# EAGLE design 16SegBoard_AutoRoute (EAGLE 9.1.0)
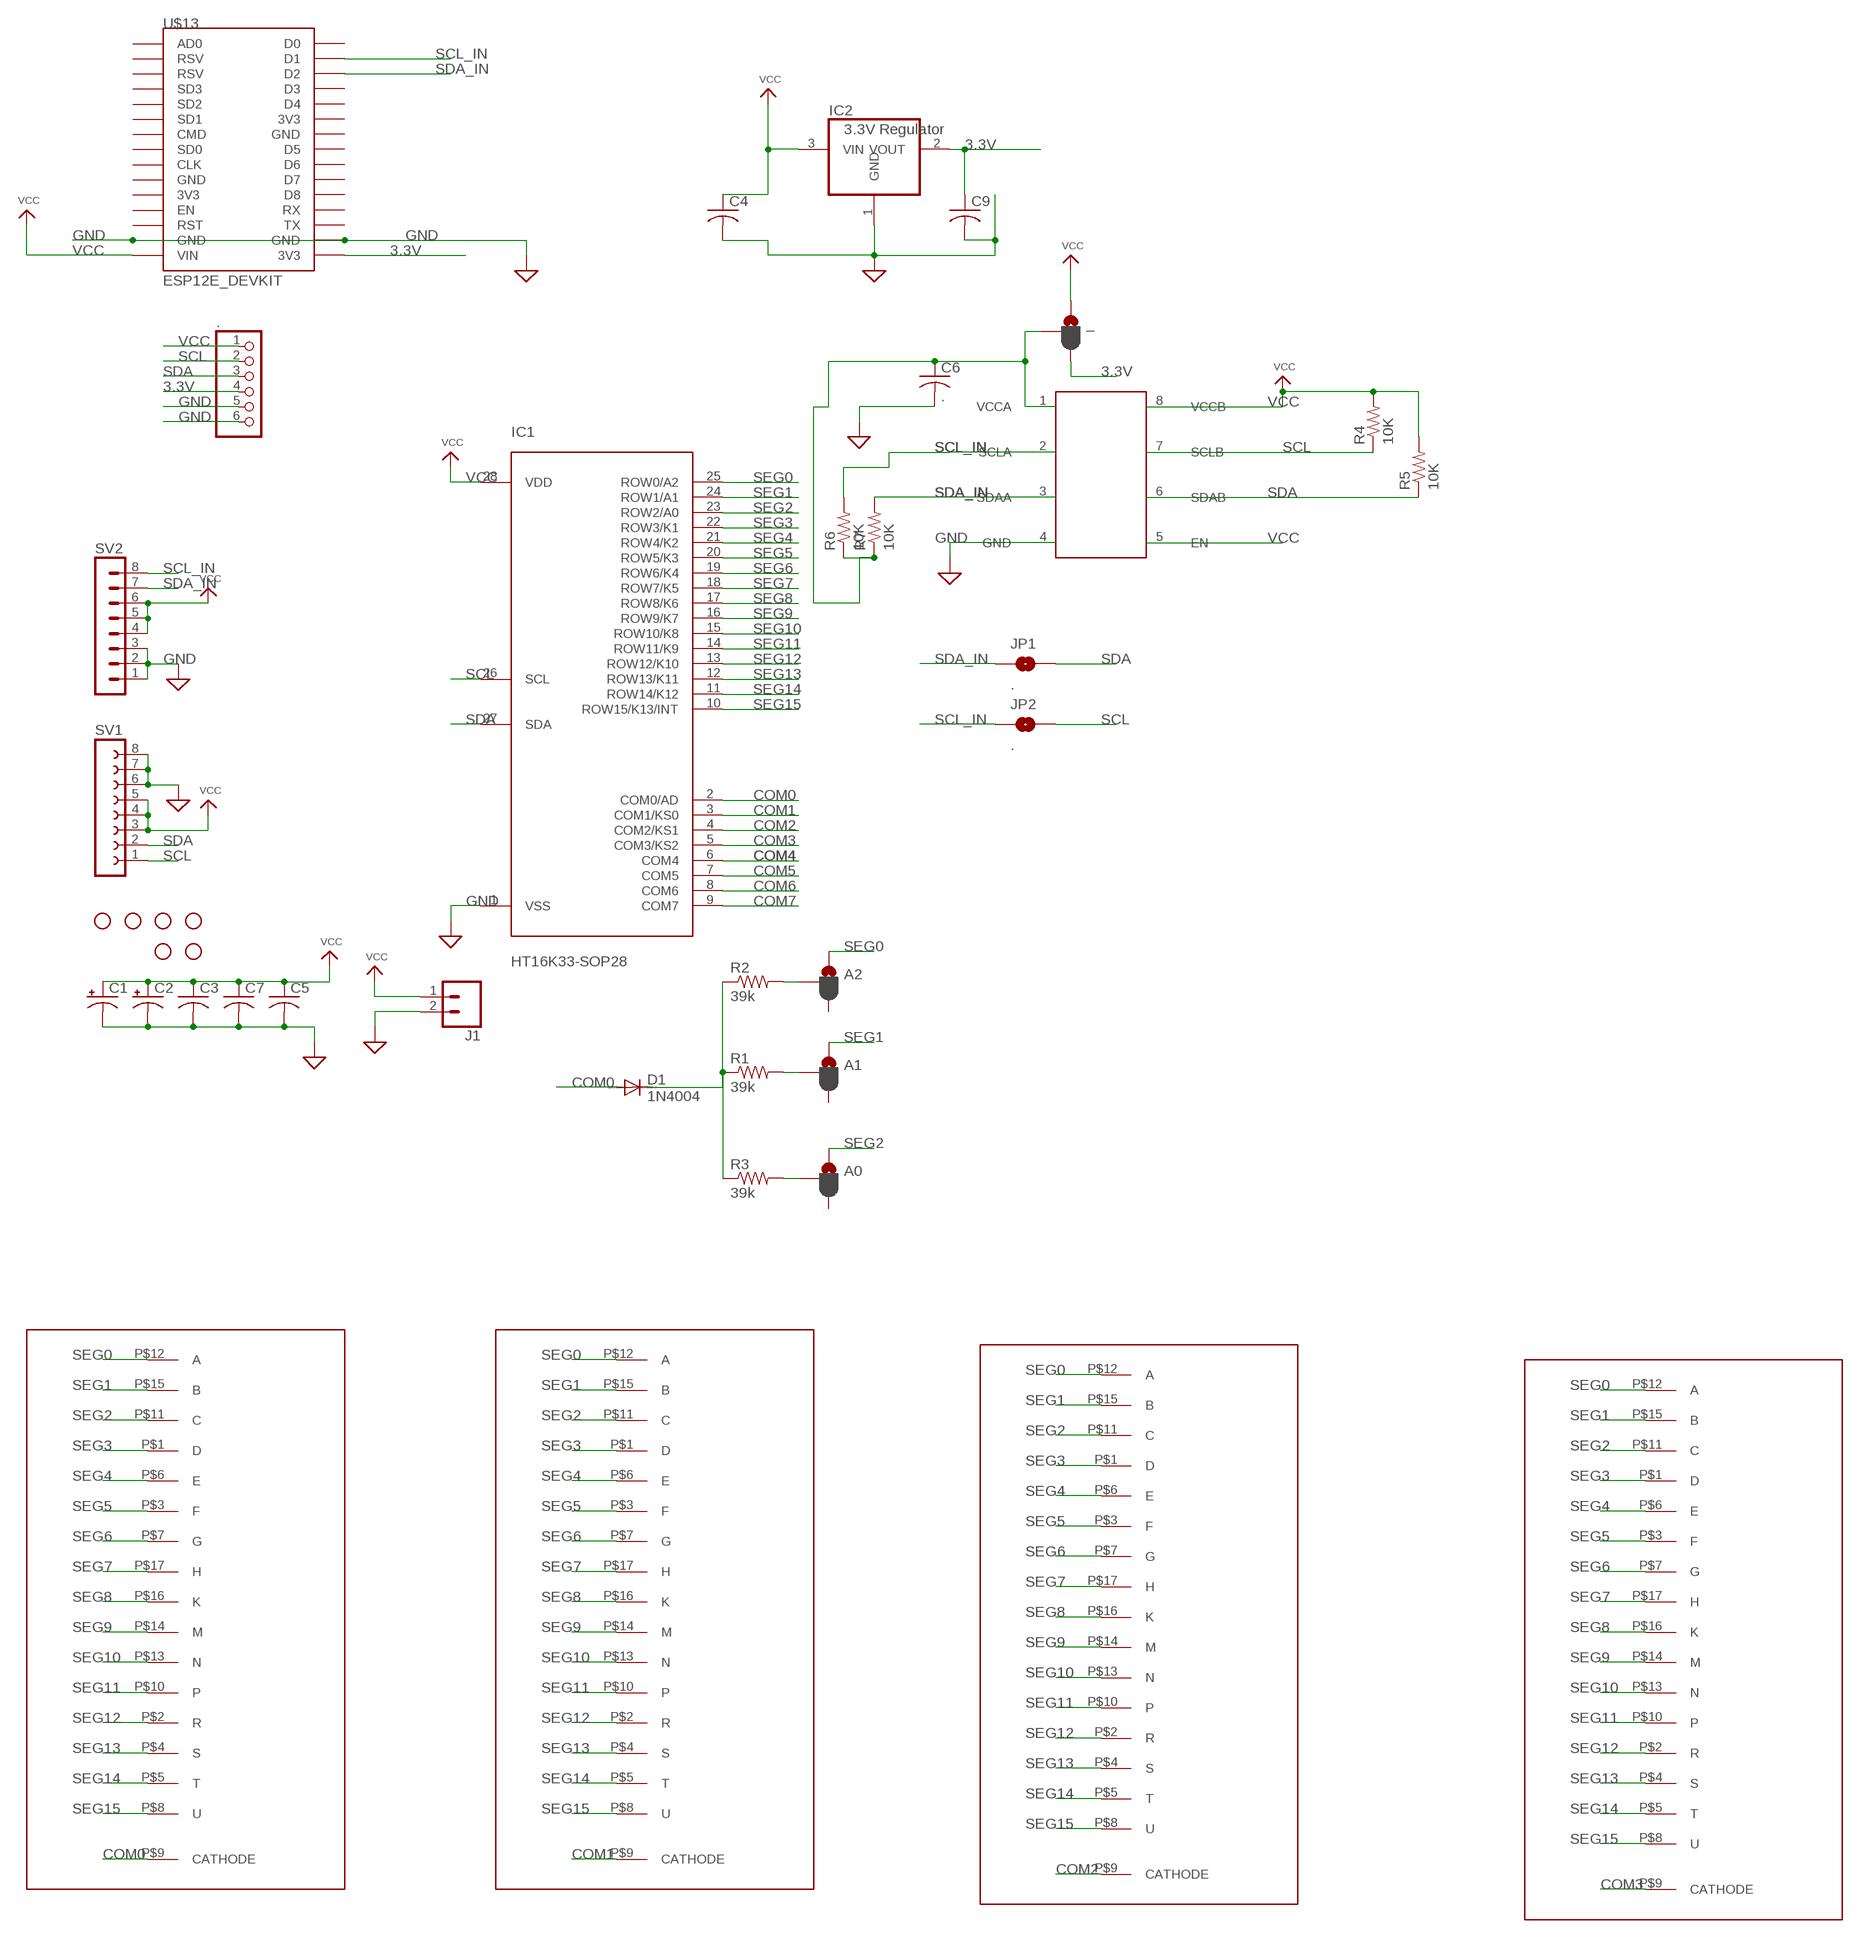
[diagram p0: schematic, sheet 1, part 1 of 2]
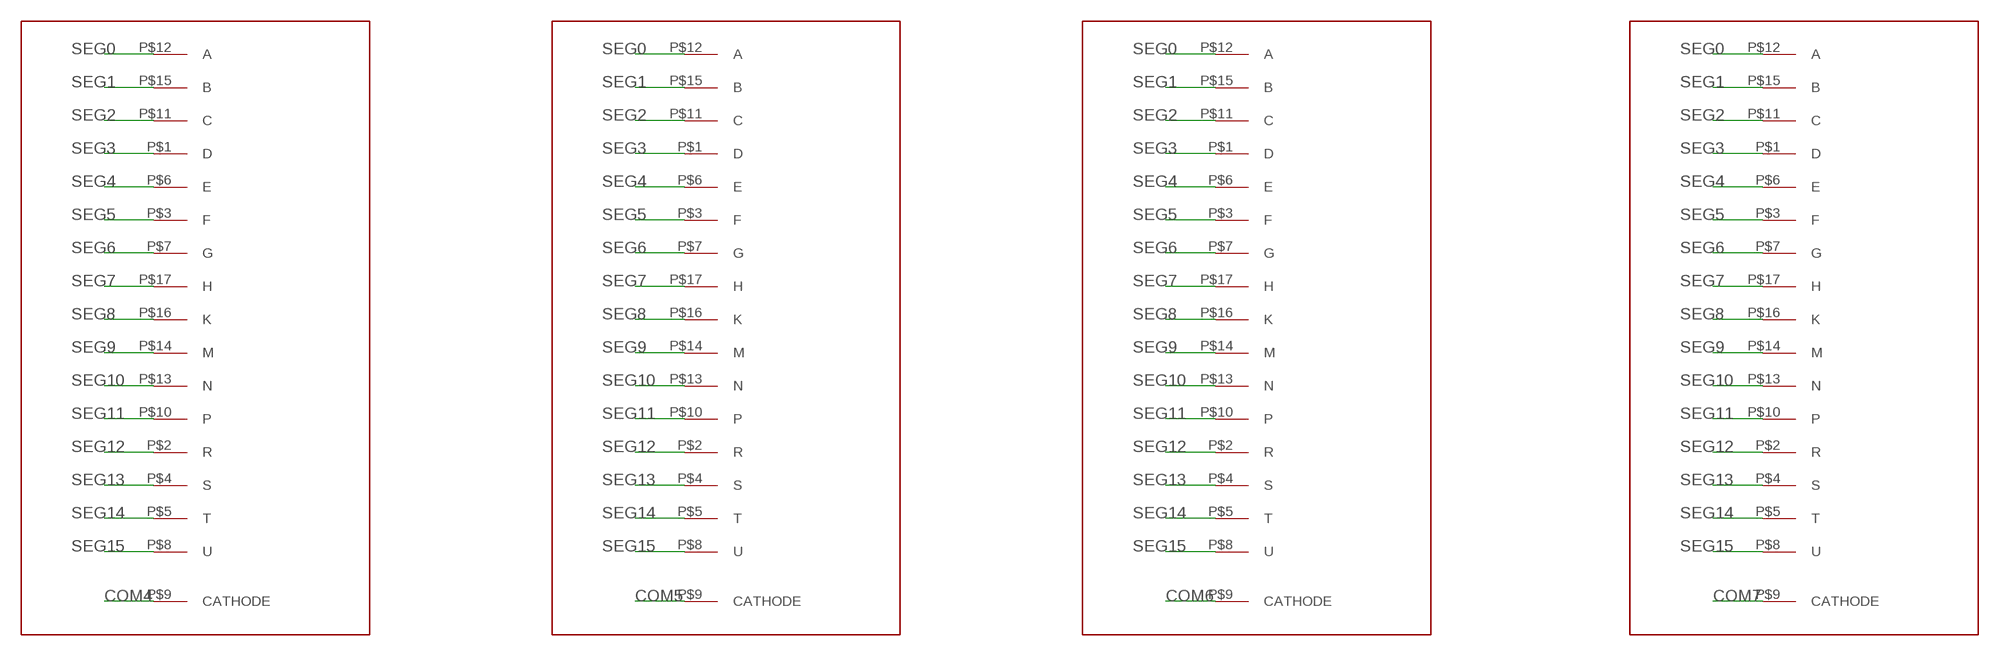
[diagram p1: schematic, sheet 1, part 2 of 2]

## Parts
.  PINHD-1X6  [1X06]
_  JUMPER-SMT_3_1-NC_PASTE_SILK  [SMT-JUMPER_3_1-NC_PASTE_SILK]
A0  JUMPER-SMT_3_1-NC_PASTE_SILK  [SMT-JUMPER_3_1-NC_PASTE_SILK]
A1  JUMPER-SMT_3_1-NC_PASTE_SILK  [SMT-JUMPER_3_1-NC_PASTE_SILK]
A2  JUMPER-SMT_3_1-NC_PASTE_SILK  [SMT-JUMPER_3_1-NC_PASTE_SILK]
C1  CPOL-USE2.5-6  [E2,5-6]
C2  CPOL-USE2.5-6  [E2,5-6]
C3  C-USC0805  [C0805]
C4  C-USC0805  [C0805]
C5  C-US025-030X050  [C025-030X050]
C6  .  C-USC0805  [C0805]
C7  C-USC0805  [C0805]
C9  C-USC0805  [C0805]
D1  1N4004  [DO41-10]
H1  STAND-OFF  [STAND-OFF]
H2  STAND-OFF  [STAND-OFF]
H3  STAND-OFF  [STAND-OFF]
H4  STAND-OFF  [STAND-OFF]
H5  STAND-OFF  [STAND-OFF]
H6  STAND-OFF  [STAND-OFF]
IC1  HT16K33-SOP28  [SOIC127P1031X264-28N]
IC2  3.3V Regulator  REG1117  [SOT223]
J1  CONN_025MM  [SCREWTERMINAL-5MM-2]
JP1  .  JUMPER-SMT_2_NO_NO-SILK  [SMT-JUMPER_2_NO_NO-SILK]
JP2  .  JUMPER-SMT_2_NO_NO-SILK  [SMT-JUMPER_2_NO_NO-SILK]
R1  39k  R-US_M1206  [M1206]
R2  39k  R-US_M1206  [M1206]
R3  39k  R-US_M1206  [M1206]
R4  10K  R-US_R1206  [R1206]
R5  10K  R-US_R1206  [R1206]
R6  10K  R-US_R1206  [R1206]
R7  10K  R-US_R1206  [R1206]
SV1  FE08W  [FE08W]
SV2  MA08-1W  [MA08-1W]
TCA9517  TCA9517  [SOIC-8]
U$1  16SEG  [16SEGLARGE_PKG]
U$2  16SEG  [16SEGLARGE_PKG]
U$3  16SEG  [16SEGLARGE_PKG]
U$4  16SEG  [16SEGLARGE_PKG]
U$5  16SEG  [16SEGLARGE_PKG]
U$6  16SEG  [16SEGLARGE_PKG]
U$7  16SEG  [16SEGLARGE_PKG]
U$8  16SEG  [16SEGLARGE_PKG]
U$13  ESP12E_DEVKIT  [ESP12E_DEVKIT]

## Nets
3.3V: ..4 _.3 C9.1 IC2.2(VOUT) U$13.3V3@2(3V3)
COM0: D1.A IC1.2(COM0/AD) U$1.P$9(CATHODE)
COM1: IC1.3(COM1/KS0) U$2.P$9(CATHODE)
COM2: IC1.4(COM2/KS1) U$3.P$9(CATHODE)
COM3: IC1.5(COM3/KS2) U$4.P$9(CATHODE)
COM4: IC1.6(COM4) U$5.P$9(CATHODE)
COM5: IC1.7(COM5) U$6.P$9(CATHODE)
COM6: IC1.8(COM6) U$7.P$9(CATHODE)
COM7: IC1.9(COM7) U$8.P$9(CATHODE)
GND: ..5 ..6 C1.- C2.- C3.2 C4.2 C5.2 C6.2 C7.2 C9.2 IC1.1(VSS) IC2.1(GND) J1.2 SV1.6 SV1.7 SV1.8 SV2.1 SV2.2 SV2.3 TCA9517.4(GND) U$13.GND@1(GND) U$13.GND@3(GND) ; supply symbol labelled SUP
N$1: D1.C R1.1 R2.1 R3.1
N$2: A0.2 R3.2
N$3: A1.2 R1.2
N$4: A2.2 R2.2
N$5: _.2 C6.1 R6.1 R7.1 TCA9517.1(VCCA)
SCL: ..2 IC1.26(SCL) JP2.2 R4.1 SV1.1 TCA9517.7(SCLB)
SCL_IN: JP2.1 R6.2 SV2.8 TCA9517.2(SCLA) U$13.D1
SDA: ..3 IC1.27(SDA) JP1.2 R5.1 SV1.2 TCA9517.6(SDAB)
SDA_IN: JP1.1 R7.2 SV2.7 TCA9517.3(SDAA) U$13.D2
SEG0: A2.1 IC1.25(ROW0/A2) U$1.P$12(A) U$2.P$12(A) U$3.P$12(A) U$4.P$12(A) U$5.P$12(A) U$6.P$12(A) U$7.P$12(A) U$8.P$12(A)
SEG1: A1.1 IC1.24(ROW1/A1) U$1.P$15(B) U$2.P$15(B) U$3.P$15(B) U$4.P$15(B) U$5.P$15(B) U$6.P$15(B) U$7.P$15(B) U$8.P$15(B)
SEG2: A0.1 IC1.23(ROW2/A0) U$1.P$11(C) U$2.P$11(C) U$3.P$11(C) U$4.P$11(C) U$5.P$11(C) U$6.P$11(C) U$7.P$11(C) U$8.P$11(C)
SEG3: IC1.22(ROW3/K1) U$1.P$1(D) U$2.P$1(D) U$3.P$1(D) U$4.P$1(D) U$5.P$1(D) U$6.P$1(D) U$7.P$1(D) U$8.P$1(D)
SEG4: IC1.21(ROW4/K2) U$1.P$6(E) U$2.P$6(E) U$3.P$6(E) U$4.P$6(E) U$5.P$6(E) U$6.P$6(E) U$7.P$6(E) U$8.P$6(E)
SEG5: IC1.20(ROW5/K3) U$1.P$3(F) U$2.P$3(F) U$3.P$3(F) U$4.P$3(F) U$5.P$3(F) U$6.P$3(F) U$7.P$3(F) U$8.P$3(F)
SEG6: IC1.19(ROW6/K4) U$1.P$7(G) U$2.P$7(G) U$3.P$7(G) U$4.P$7(G) U$5.P$7(G) U$6.P$7(G) U$7.P$7(G) U$8.P$7(G)
SEG7: IC1.18(ROW7/K5) U$1.P$17(H) U$2.P$17(H) U$3.P$17(H) U$4.P$17(H) U$5.P$17(H) U$6.P$17(H) U$7.P$17(H) U$8.P$17(H)
SEG8: IC1.17(ROW8/K6) U$1.P$16(K) U$2.P$16(K) U$3.P$16(K) U$4.P$16(K) U$5.P$16(K) U$6.P$16(K) U$7.P$16(K) U$8.P$16(K)
SEG9: IC1.16(ROW9/K7) U$1.P$14(M) U$2.P$14(M) U$3.P$14(M) U$4.P$14(M) U$5.P$14(M) U$6.P$14(M) U$7.P$14(M) U$8.P$14(M)
SEG10: IC1.15(ROW10/K8) U$1.P$13(N) U$2.P$13(N) U$3.P$13(N) U$4.P$13(N) U$5.P$13(N) U$6.P$13(N) U$7.P$13(N) U$8.P$13(N)
SEG11: IC1.14(ROW11/K9) U$1.P$10(P) U$2.P$10(P) U$3.P$10(P) U$4.P$10(P) U$5.P$10(P) U$6.P$10(P) U$7.P$10(P) U$8.P$10(P)
SEG12: IC1.13(ROW12/K10) U$1.P$2(R) U$2.P$2(R) U$3.P$2(R) U$4.P$2(R) U$5.P$2(R) U$6.P$2(R) U$7.P$2(R) U$8.P$2(R)
SEG13: IC1.12(ROW13/K11) U$1.P$4(S) U$2.P$4(S) U$3.P$4(S) U$4.P$4(S) U$5.P$4(S) U$6.P$4(S) U$7.P$4(S) U$8.P$4(S)
SEG14: IC1.11(ROW14/K12) U$1.P$5(T) U$2.P$5(T) U$3.P$5(T) U$4.P$5(T) U$5.P$5(T) U$6.P$5(T) U$7.P$5(T) U$8.P$5(T)
SEG15: IC1.10(ROW15/K13/INT) U$1.P$8(U) U$2.P$8(U) U$3.P$8(U) U$4.P$8(U) U$5.P$8(U) U$6.P$8(U) U$7.P$8(U) U$8.P$8(U)
VCC: ..1 _.1 C1.+ C2.+ C3.1 C4.1 C5.1 C7.1 IC1.28(VDD) IC2.3(VIN) J1.1 R4.2 R5.2 SV1.3 SV1.4 SV1.5 SV2.4 SV2.5 SV2.6 TCA9517.5(EN) TCA9517.8(VCCB) U$13.VIN
Unconnected: A0.3 A1.3 A2.3 U$13.3V3@0(3V3) U$13.3V3@1(3V3) U$13.AD0 U$13.CLK U$13.CMD U$13.D0 U$13.D3 U$13.D4 U$13.D5 U$13.D6 U$13.D7 U$13.D8 U$13.EN U$13.GND@0(GND) U$13.GND@2(GND) U$13.RST U$13.RSV@0(RSV) U$13.RSV@1(RSV) U$13.RX U$13.SD0 U$13.SD1 U$13.SD2 U$13.SD3 U$13.TX

## Library data of the parts
. = pinhead:PINHD-1X6: PIN HEADER
_ A0 A1 A2 = SparkFun-Jumpers:JUMPER-SMT_3_1-NC_PASTE: Normally closed solder jumper (1 of 2 connections) This jumper has an aperture in the stencil to allow solder paste to bridge one of the two connections. One connection is normally closed (NC), while the other is normally open (NO). Wick off the solder to open the connection. Reapply solder to reclose the connection. Apply solder to the other side instead to change the current path.
C1 C2 = rcl:CPOL-US: POLARIZED CAPACITOR, American symbol; SPICEPREFIX: C
C3-C7 C9 = rcl:C-US: CAPACITOR, American symbol; SPICEPREFIX: C
D1 = diode:1N4004: DIODE general purpose rectifier, 1 A
H1-H6 = SparkFun-Hardware:STAND-OFF: Stand Off Drill holes for mechanically mounting via screws, standoffs, etc. Note: Use the keepout ring to avoid running the screw head into surrounding components. Variant Overviews STAND-OFF - Mechanical footprint for a #4 phillips button head screw. STAND-OFF-TIGHT - Mechanical footprint for a #4 phillips button head screw, Example SparkFun Products Screw - Phillips Head (1/4", 4-40, 10 pack) <https://www.sparkfun.com/products/10453> (PRT-10453) Screw - Phillips Head (1/2", 4-40, 10 pack) <https://www.sparkfun.com/products/10452> (PRT-10452) Screw - Phillips Head (3/4", 4-40, 10 pack) <https://www.sparkfun.com/products/10451> (PRT-10451) Screw - Phillips Head (1", 4-40, 10 pack) <https://www.sparkfun.com/products/10450> (PRT-10450)
IC1 = holtek-led-controller-v1:HT16K33-SOP28: RAM Mapping 16*8 LED Controller Driver with keyscan
IC2 = burr-brown:REG1117: 800mA and 1A Low Dropout (LDO) Positive Regulator 1.8V, 2.5V, 2.85V, 3.3V, 5V, and Adj; MPN: REG1117; OC_FARNELL: 1097566; OC_NEWARK: 14P6981
J1 = SparkFun-Connectors:CONN_02: Multi connection point. Often used as Generic Header-pin footprint for 0.1 inch spaced/style header connections On any of the 0.1 inch spaced packages, you can populate with these: Break Away Headers - Straight <https://www.sparkfun.com/products/116> (PRT-00116) Break Away Male Headers - Right Angle <https://www.sparkfun.com/products/553> (PRT-00553) Female Headers <https://www.sparkfun.com/products/115> (PRT-00115) Break Away Headers - Machine Pin <https://www.sparkfun.com/products/117> (PRT-00117) Break Away Female Headers - Swiss Machine Pin <https://www.sparkfun.com/products/743> (PRT-00743) For SCREWTERMINALS and SPRING TERMINALS visit here: Screw Terimnals on SparkFun.com <https://www.sparkfun.com/search/results?term=Screw+Terminals> (5mm/3.5mm/2.54mm spacing) This device is also useful as a general connection point to wire up your design to another part of your project. Our various solder wires solder well into these plated through hole pads. Hook-Up Wire - Assortment (Stranded, 22 AWG) <https://www.sparkfun.com/products/11375> (PRT-11375) Hook-Up Wire - Assortment (Solid Core, 22 AWG) <https://www.sparkfun.com/products/11367> (PRT-11367) View the entire wire category on our website here <https://www.sparkfun.com/categories/141> Special notes: Molex polarized connector foot print use with: PRT-08233 with associated crimp pins and housings. 2.54_SCREWTERM for use with PRT-10571. 3.5mm Screw Terminal footprints for PRT-08084 5mm Screw Terminal footprints for use with PRT-08432; SF_SKU: PRT-08432
JP1 JP2 = SparkFun-Jumpers:JUMPER-SMT_2_NO: Normally open jumper This jumper has two pads in close proximity to each other. Apply solder to close the connection. Round pads are easier to solder for beginners, but are a lot larger. SparkFun Product that uses the round pads: SparkFun EL Sequencer <https://www.sparkfun.com/products/12781>
R1-R7 = resistor:R-US_: RESISTOR, American symbol
SV1 = con-lsta:FE08W: FEMALE HEADER; OC_FARNELL: unknown; OC_NEWARK: unknown
SV2 = con-lstb:MA08-1W: PIN HEADER; OC_FARNELL: unknown; OC_NEWARK: unknown
TCA9517 = TCA9517:TCA9517
U$1-U$8 = 16SegLarge:16SEG
U$13 = ESP12E_DEVKIT:ESP12E_DEVKIT: ESP12E DEVKIT BOARD

## Board
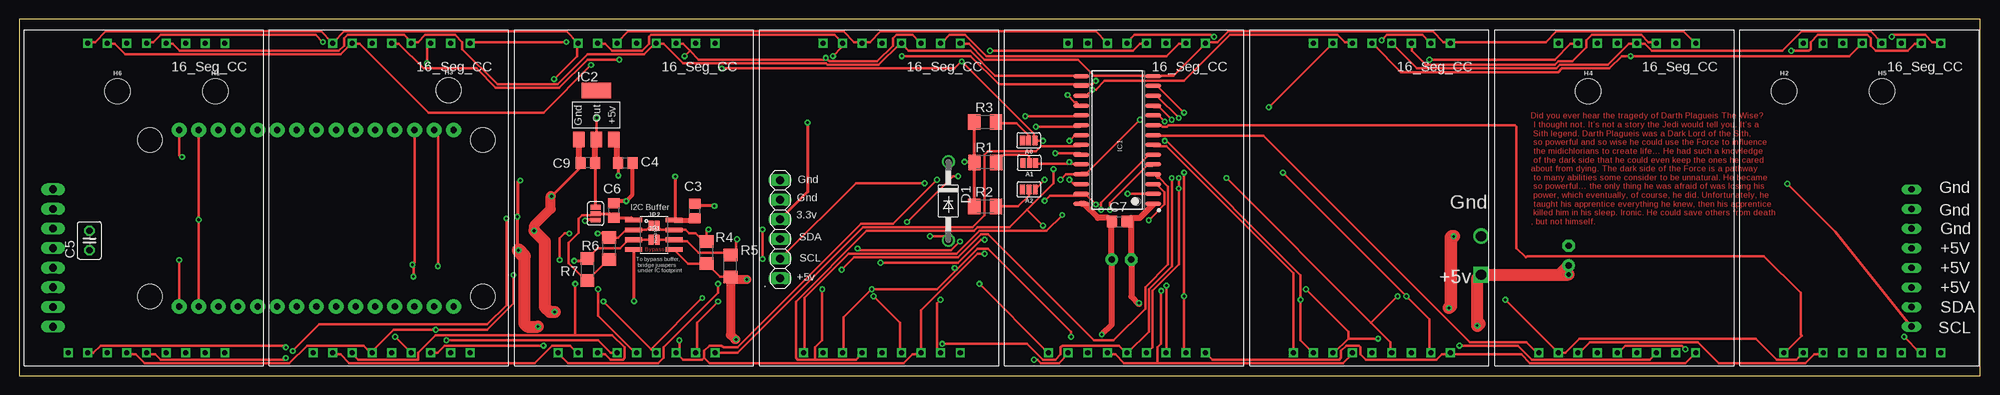
[diagram p2: board, top side]
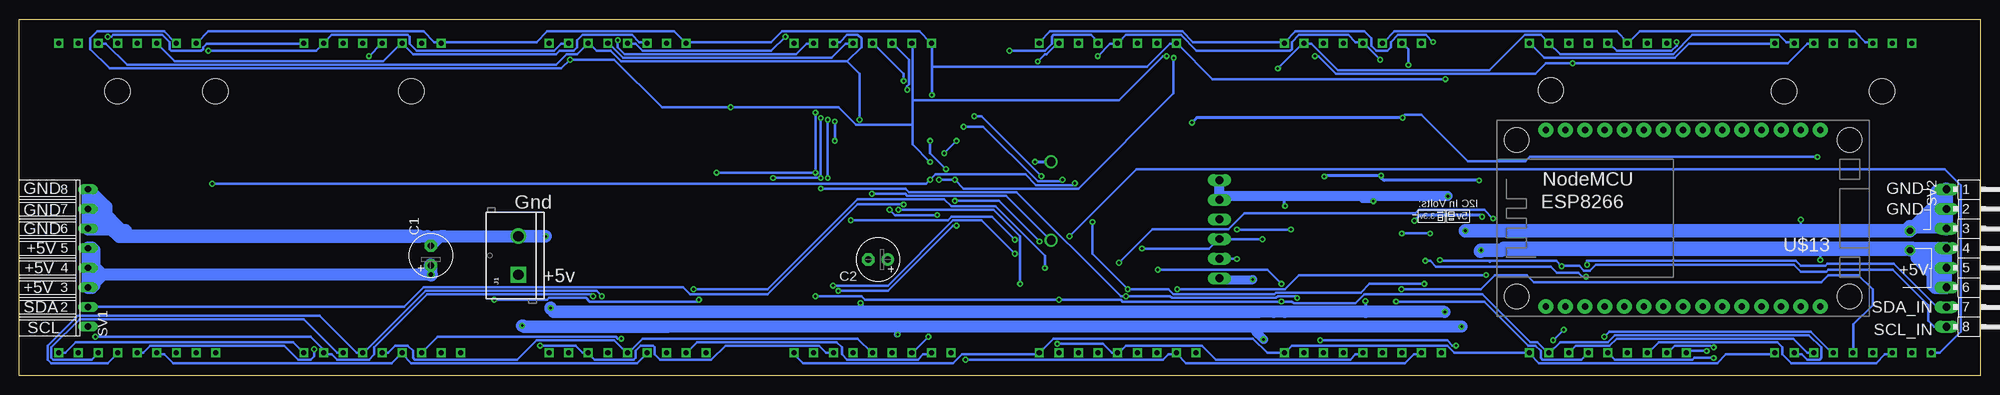
[diagram p3: board, bottom side, seen from below]

Size 254 x 46.15 mm. Coordinates in mm from the lower left corner, seen from the top.
Outline: 0,0 254,0 254,46.15 0,46.15 0,0
Copper layers (1*16): Top 0.035mm / dielectric 1.5mm / Bottom 0.035mm
Design rules "default *": minimum track width 12mil, minimum drill 0.35mm, track to track 6mil, track to pad 6mil, pad to pad 6mil, via to via 6mil, smd to smd 6mil, copper to edge 40mil, drill to drill 6mil, minimum pad ring 10mil, minimum via ring 8mil, stop-mask expansion 4mil, vias tented up to drill 0mil, thermal gap 10mil

### Footprints (pad centres in the part's own frame; a part is rotated, then mirrored left to right if it is on the bottom)
1X06 = drill 1.016 long: 1 -6.35,0; 2 -3.81,0; 3 -1.27,0; 4 1.27,0; 5 3.81,0; 6 6.35,0
SMT-JUMPER_3_1-NC_PASTE_SILK = smd 0.635 x 1.27: 1 -0.813,0; 2 0,0; 3 0.813,0
E2,5-6 = drill 0.813 pad 1.6: + -1.27,0 | drill 0.813 pad 1.6 octagon: - 1.27,0
C0805 = smd 1.3 x 1.5: 1 -0.95,0; 2 0.95,0
C025-030X050 = drill 0.813 octagon: 1 -1.27,0; 2 1.27,0
DO41-10 = drill 1.118: A 5.08,0; C -5.08,0
STAND-OFF = hole 3.302: 0,0
SOIC127P1031X264-28N = smd 2.05 x 0.6: 1 -4.65,8.255; 2 -4.65,6.985; 3 -4.65,5.715; 4 -4.65,4.445; 5 -4.65,3.175; 6 -4.65,1.905; 7 -4.65,0.635; 8 -4.65,-0.635; 9 -4.65,-1.905; 10 -4.65,-3.175; 11 -4.65,-4.445; 12 -4.65,-5.715; 13 -4.65,-6.985; 14 -4.65,-8.255; 15 4.65,-8.255; 16 4.65,-6.985; 17 4.65,-5.715; 18 4.65,-4.445; 19 4.65,-3.175; 20 4.65,-1.905; 21 4.65,-0.635; 22 4.65,0.635; 23 4.65,1.905; 24 4.65,3.175; 25 4.65,4.445; 26 4.65,5.715; 27 4.65,6.985; 28 4.65,8.255
SOT223 = smd 1.499 x 2.007: 1 -2.261,-3.15; 2 0.025,-3.15; 3 2.311,-3.15 | smd 3.81 x 2.007: 4 0,3.15
SCREWTERMINAL-5MM-2 = drill 1.3 pad 2.032 square: 1 0,0 | drill 1.3 pad 2.032: 2 5,0
SMT-JUMPER_2_NO_NO-SILK = smd 0.635 x 1.27: 1 -0.406,0; 2 0.406,0
M1206 = smd 1.6 x 2: 1 -1.4,0; 2 1.4,0
R1206 = smd 1.6 x 1.803: 1 -1.422,0; 2 1.422,0
FE08W = drill 0.813 long: 1 -8.89,0; 2 -6.35,0; 3 -3.81,0; 4 -1.27,0; 5 1.27,0; 6 3.81,0; 7 6.35,0; 8 8.89,0
MA08-1W = drill 1.016 long: 1 -8.89,0; 2 -6.35,0; 3 -3.81,0; 4 -1.27,0; 5 1.27,0; 6 3.81,0; 7 6.35,0; 8 8.89,0
SOIC-8 = smd 0.61 x 2.21: 1 -1.905,-2.616; 2 -0.635,-2.616; 3 0.635,-2.616; 4 1.905,-2.616; 5 1.905,2.616; 6 0.635,2.616; 7 -0.635,2.616; 8 -1.905,2.616
16SEGLARGE_PKG = drill 0.65 square: P$1 26,1.7; P$2 23.46,1.7; P$3 20.92,1.7; P$4 18.38,1.7; P$5 15.84,1.7; P$6 13.3,1.7; P$7 10.76,1.7; P$8 8.22,1.7; P$9 5.68,1.7; P$10 26,41.8; P$11 23.46,41.8; P$12 20.92,41.8; P$13 18.38,41.8; P$14 15.84,41.8; P$15 10.76,41.8; P$16 13.3,41.8; P$17 8.22,41.8
ESP12E_DEVKIT = drill 0.8 pad 1.93: 3V3@0 -11.43,-7.62; 3V3@1 11.43,5.08; 3V3@2 11.43,-17.78; AD0 -11.43,17.78; CLK -11.43,-2.54; CMD -11.43,2.54; D0 11.43,17.78; D1 11.43,15.24; D2 11.43,12.7; D3 11.43,10.16; D4 11.43,7.62; D5 11.43,0; D6 11.43,-2.54; D7 11.43,-5.08; D8 11.43,-7.62; EN -11.43,-10.16; GND@0 -11.43,-5.08; GND@1 -11.43,-15.24; GND@2 11.43,2.54; GND@3 11.43,-15.24; RST -11.43,-12.7; RSV@0 -11.43,15.24; RSV@1 -11.43,12.7; RX 11.43,-10.16; SD0 -11.43,0; SD1 -11.43,5.08; SD2 -11.43,7.62; SD3 -11.43,10.16; TX 11.43,-12.7; VIN -11.43,-17.78 | hole 3.2: -10.16,21.59; 10.16,21.59; 10.16,-21.59; -10.16,-21.59

### Placement (x,y rotation side)
.  98.55,18.96 90 top
_  74.64,20.97 90 top
A0  130.74,30.45 180 top
A1  130.83,27.54 180 top
A2  130.78,24.11 180 top
C1  200.69,15.54 90 bottom
C2  142.76,15.03 180 bottom
C3  87.49,21.32 90 top
C4  78.49,27.56 0 top
C5  9.1,17.51 90 top
C6  77.04,21.4 90 top
C7  142.49,19.94 0 top
C9  73.66,27.56 180 top
D1  120.33,22.62 270 top
H1  25.4,36.83 0 top
H2  228.6,36.83 0 top
H3  55.63,36.96 0 top
H4  203.2,36.83 0 top
H5  241.3,36.83 0 top
H6  12.7,36.83 0 top
IC1  142.22,30.53 180 top
IC2  74.72,33.75 0 top
J1  189.35,13.07 90 bottom
JP1  82.24,17.61 0 top
JP2  82.22,19.41 0 top
R1  125.14,27.63 0 top
R2  125.11,21.88 0 top
R3  125.11,32.83 0 top
R4  89.03,15.93 270 top
R5  92.11,14.21 270 top
R6  76.39,16.47 90 top
R7  73.58,13.74 90 top
SV1  245.1,15.24 90 bottom
SV2  4.37,15.24 270 bottom
TCA9517  82.2,18.24 270 top
U$1  0.64,1.27 0 top
U$2  32.38,1.27 0 top
U$3  64.14,1.27 0 top
U$4  95.89,1.27 0 top
U$5  127.64,1.27 0 top
U$6  159.38,1.27 0 top
U$7  191.13,1.27 0 top
U$8  222.88,1.27 0 top
U$13  38.48,20.38 90 bottom

### Tracks (layer width: path | path; a pad name or v marks a point on that pad's centre or on a via)
3.3V  (via drill 0.35)
  Top 0.356: U$13.3V3@2 20.7,28.57 20.95,28.32 v21.08,28.32 | v74.8,33.4 74.8,30.66 IC2.2
  Top 0.406: C9.1 74.61,21.82 _.3 | v102.11,32.77 102.11,23.79 ..4
  Top 0.762: C9.1 74.61,30.46 74.8,30.66
  Bottom 0.356: v21.08,28.32 58.34,28.32 58.92,27.75 66.36,27.75 72.39,33.78 74.55,33.78 74.8,33.53 v74.8,33.4
  Bottom 0.406: v74.8,33.4 101.47,33.4 v102.11,32.77
COM0  (via drill 0.35)
  Top 0.305: v143.56,23.55 146.76,23.55 IC1.2 | v117.96,18.06 119.79,18.06 120.24,17.6 D1.A
  Bottom 0.305: v143.56,23.55 139.22,23.55 138.99,23.32 126.19,23.32 120.47,17.6 D1.A | v117.96,18.06 109.27,26.75 4.57,26.75 2.52,24.69 2.52,5.71 5.26,2.97 6.17,2.97 U$1.P$9
COM1  (via drill 0.35)
  Top 0.305: v146.3,20.12 148.36,22.17 148.36,23.77 147.45,24.69 146.99,24.69 IC1.3 | v125.04,17.6 124.59,17.6 121.61,14.63 v111.56,14.63 | v63.09,20.34 63.09,9.14 60.58,6.63 38.86,6.63 v35.43,3.2
  Bottom 0.305: v146.3,20.12 133.73,20.12 133.27,20.57 128.02,20.57 v125.04,17.6 | v111.56,14.63 107.21,18.97 97.38,18.97 95.33,21.03 73.15,21.03 72.69,21.49 64.24,21.49 v63.09,20.34 | v35.43,3.2 37.72,3.2 37.95,2.97 U$2.P$9
COM2  (via drill 0.35)
  Top 0.305: v106.53,13.72 108.13,15.32 121.61,15.32 124.59,18.29 125.5,18.29 139.22,4.57 141.73,4.57 145.85,8.69 145.85,11.43 148.82,14.4 148.82,24.46 147.68,25.6 147.45,25.6 146.99,26.06 IC1.4 | v90.53,11.89 90.53,10.74 83.44,3.66 83.44,2.29 82.75,1.6 71.09,1.6 69.95,2.74 U$3.P$9
  Bottom 0.305: v106.53,13.72 92.35,13.72 v90.53,11.89
COM3  (via drill 0.35)
  Top 0.305: v141.28,21.49 141.28,22.4 146.07,27.2 146.76,27.2 IC1.5 | v135.1,20.8 133.04,18.75 124.36,18.75 121.39,15.77 107.44,15.77 101.73,10.06 101.73,2.97 U$4.P$9
  Bottom 0.305: v141.28,21.49 140.59,20.8 v135.1,20.8
COM4  (via drill 0.35)
  Top 0.305: v140.13,21.49 140.13,22.4 146.3,28.57 146.76,28.57 IC1.6 | v124.36,11.89 133.27,2.97 U$5.P$9
  Bottom 0.305: v140.13,21.49 127.79,21.49 124.36,18.06 v124.36,11.89
COM5
  Top 0.305: IC1.7 146.99,29.72 148.59,29.72 165.05,13.26 U$6.P$9
COM6
  Top 0.305: IC1.8 146.99,31.09 161.16,31.09 187.91,4.34 195.22,4.34 196.6,2.97 U$7.P$9
COM7
  Top 0.305: U$8.P$9 228.37,2.97 228.71,2.97 230.89,5.14 230.76,5.27 230.76,10.73 226,15.49 195.33,15.49 195.14,15.3 193.93,16.51 193.93,32.23 193.73,32.43 148.84,32.43 148.64,32.23 148.08,32.23 147.88,32.43 IC1.9
GND  (via drill 0.35)
  Top 0.305: U$13.GND@3 v23.24,20.2 | v23.24,20.2 v23.24,20.19 | U$13.GND@1 v23.24,20.2
  Top 0.381: v90.04,21.97 87.8,21.97 C3.2 | TCA9517.4 79.59,9.82 79.63,9.78 v79.63,9.65 | v68.96,23.24 72.46,26.74 72.46,27.81
  Top 0.508: C6.2 77.3,22.61 v78.61,22.61 79.44,23.43 C4.2 | 68.83,23.24 v68.96,23.24 | 146.87,22.15 IC1.1
  Top 0.762: IC2.1 72.46,27.81 C9.2 | C7.2 143.73,20.23 | 143.73,20.23 143.95,20.45 145.16,20.45 146.87,22.15 | 143.73,20.23 144.03,19.92 C2.- 144.03,10.27 145.03,9.27 v145.03,9.4
  Top 1.27: v66.69,18.78 66.69,19.45 68.83,21.59 68.83,23.24
  Top 1.524: v66.69,18.78 68.07,17.4 68.07,8.89 68.71,8.26 v69.34,8.26
  Top 1.651: v185.17,8.76 185.42,9.02 185.42,17.91 185.55,18.03 v185.8,18.03
  Bottom 0.305: v23.24,20.19 23.24,18.9 23.11,18.78 | SV2.2 4.34,21.72 4.37,21.72
  Bottom 0.381: 90.17,23.24 90.17,22.1 v90.04,21.97 | 80.77,23.24 80.14,22.61 v78.61,22.61 | v79.63,9.65 79.63,8.26
  Bottom 0.762: v145.03,9.4 145.03,8.76 145.54,8.26
  Bottom 1.016: 8.82,19.05 SV2.3
  Bottom 1.27: SV1.6 SV1.7 245.1,23.37 SV1.8 | v68.96,23.24 80.77,23.24 90.17,23.24 98.08,23.24 ..5 ..6
  Bottom 1.524: v69.34,8.26 79.63,8.26 90.08,8.26 90.11,8.28 91.5,8.28 91.53,8.26 93.47,8.26 | 200.69,17.59 C1.- 199.47,18.03 198.75,18.03 | 202.18,18.07 201.17,18.07 200.69,17.59 | 200.69,17.59 200.25,18.03 198.75,18.03 | 198.75,18.03 189.07,18.03 189.11,18.07 J1.2
  Bottom 1.651: 93.47,8.26 145.54,8.26 184.78,8.26 185.17,8.64 v185.17,8.76 | 189.07,18.03 v185.8,18.03
  Bottom 1.778: SV2.3 SV2.2 4.37,21.72 SV2.1 | 241.08,18.07 202.18,18.07 | 241.08,18.07 242.06,19.05 243.33,19.05 | 243.33,19.05 SV1.6 245.1,23.37 | 243.33,19.81 243.33,22.35 244.35,23.37 | 243.33,19.05 243.33,19.81 | 243.33,19.81 242.82,20.32 242.82,20.83 | 242.82,21.84 242.82,20.83 | 242.82,20.83 241.3,19.3 | 241.08,18.07 240.36,18.8 240.28,18.8 | 5.59,22.29 5.59,20.32 5.08,19.81 5.59,19.3 9.14,19.3 9.1,19.26 C5.2 23.11,18.78 v66.69,18.78 | 5.59,23.88 5.59,22.29 | 5.59,22.29 8.82,19.05
N$1  (via drill 0.35)
  Top 0.406: R2.1 123.71,27.61 R1.1 | R1.1 123.73,32.8 R3.1 | R1.1 122.5,27.63 122.43,27.56 v122.43,27.69
  Bottom 0.406: v122.43,27.69 122.42,27.7 D1.C
N$2
  Top 0.305: A0.2 130.76,30.63 130.76,31.09 129.16,32.69 126.64,32.69 R3.2
N$3
  Top 0.305: A1.2 130.76,27.66 130.76,28.35 130.53,28.57 127.56,28.57 126.64,27.66 R1.2
N$4
  Top 0.305: A2.2 130.76,24 130.76,23.32 129.39,21.95 126.64,21.95 R2.2
N$5
  Top 0.305: R6.1 76.35,15.09 73.61,12.34 R7.1 73.38,12.34 71.17,14.55 71.17,17.22 72.47,18.52 72.47,20.34 72.92,20.8 74.52,20.8 _.2
  Top 0.406: _.2 76.51,20.97 C6.1 79.28,20.45 TCA9517.1
SCL  (via drill 0.35)
  Top 0.305: R4.1 88.69,17.35 87.63,18.41 86.74,18.41 86.28,18.87 TCA9517.7 83.16,18.87 JP2.2 | v136.02,25.38 136.47,24.92 137.39,24.92 IC1.26 | v117.27,24.92 108.36,24.92 98.75,15.32 ..2 | SV1.1 235.21,18.66 v229.02,24.85
  Top 0.356: R4.1 89.03,18.67 v89.28,18.92 | v96.27,18.92 96.27,15.24 96.39,15.11 v96.27,15.11
  Bottom 0.305: v117.27,24.92 117.5,24.69 122.3,24.69 123.67,26.06 135.33,26.06 v136.02,25.38 136.54,24.85 v229.02,24.85
  Bottom 0.356: v89.28,18.92 v96.27,18.92 96.39,18.92 | v96.27,15.11 98.51,15.11 ..2
SCL_IN  (via drill 0.35)
  Top 0.305: v54.23,14.18 54.23,31.31 U$13.D1 | R6.2 77.58,17.89 78.61,18.92 78.74,18.92 78.87,18.97 79.55,18.97 TCA9517.2 81.28,18.87 JP2.1
  Top 0.356: v69.98,14.99 69.98,17.78 70.61,18.41 v71.25,18.41 | v74.93,18.41 75.82,18.41 76.35,17.89 R6.2
  Bottom 0.305: SV2.8 5.97,6.35 6.73,7.11 6.73,9.14 11.3,13.72 19.68,13.72 19.94,13.46 23.24,13.46 24.13,14.35 49.78,14.35 50.55,13.59 51.31,13.59 51.94,14.22 54.1,14.22 54.1,13.97 54.23,14.1 v54.23,14.18 54.91,14.86 63.37,14.86 63.5,14.73
  Bottom 0.356: 63.37,14.86 69.85,14.86 v69.98,14.99 | v71.25,18.41 74.8,18.41 74.93,18.29 v74.93,18.41
SDA  (via drill 0.35)
  Top 0.305: R5.1 91.86,15.88 88,15.88 86.49,17.4 85.02,17.4 TCA9517.6 84,17.6 83.95,17.65 83.9,17.61 JP1.2 | v132.82,22.63 133.5,23.32 137.39,23.32 IC1.27 137.62,23.32 138.3,23.32 v139.45,22.17 | v121.84,17.37 120.7,16.23 108.81,16.23 v108.58,16.46
  Top 0.356: R5.1 92.84,16.36 92.84,17.53 v92.96,17.65
  Bottom 0.305: v132.82,22.63 127.1,22.63 v121.84,17.37 | v108.58,16.46 99.9,16.46 98.75,17.6 ..3 | v139.45,22.17 145.39,22.17 157.05,10.52 167.11,10.52 168.02,11.43 201.62,11.43 204.14,8.91 245.06,8.91 SV1.2
  Bottom 0.356: v92.96,17.65 93,17.69 ..3
SDA_IN  (via drill 0.35)
  Top 0.305: 73.28,14.86 R7.2 74.93,16.51 77.85,16.51 78.94,17.6 TCA9517.3 JP1.1 | U$13.D2 51.18,14.61 v50.93,14.35
  Top 0.356: v51.05,12.83 51.05,14.22 v50.93,14.35
  Top 0.381: v71.88,14.86 73.28,14.86
  Bottom 0.305: SV2.7 5.59,8.89 11.18,14.48 19.81,14.48 20.07,14.22 23.24,14.22 23.88,14.86 50.93,14.86 v50.93,14.35
  Bottom 0.356: v71.88,14.86 71.25,14.86 70.48,14.1 55.63,14.1 54.86,13.34 52.07,13.34 51.56,12.83 v51.05,12.83 50.93,12.83
SEG0  (via drill 0.35)
  Top 0.305: 86.87,42.06 88.01,40.92 104.47,40.92 | 86.87,42.06 85.95,42.98 85.27,42.98 U$3.P$12 | 104.47,40.92 104.7,40.92 104.93,40.69 111.1,40.69 113.16,42.75 113.16,43.66 113.61,44.12 115.67,44.12 116.59,43.2 U$4.P$12 | v52.81,40.46 52.81,42.52 53.26,42.98 U$2.P$12 | v86.18,41.38 86.87,42.06 | v132.82,25.38 131.67,24.23 A2.1 | v134.87,25.38 135.56,26.06 137.39,26.06 IC1.25 137.62,26.29 138.3,26.29 v145.16,33.15 | U$7.P$12 211.91,43.2 211,43.2 210.08,44.12 203.68,44.12 203,43.43 203,42.52 201.17,40.69 199.34,40.69 198.88,40.23 182.19,40.23 180.37,42.06 180.37,42.98 U$6.P$12 | v104.47,41.15 104.47,40.92
  Bottom 0.305: U$1.P$12 21.72,42.98 22.4,42.98 24.92,40.46 v52.81,40.46 56.24,40.46 57.61,39.09 83.44,39.09 85.72,41.38 v86.18,41.38 | v134.87,25.38 v132.82,25.38 131.67,24.23 116.81,24.23 104.47,36.58 v104.47,41.15 | 146.76,40.69 144.93,42.52 144.93,43.66 145.39,44.12 146.76,44.12 147.68,43.2 148.36,43.2 U$5.P$12 | 146.76,40.69 176.02,40.69 177.39,42.06 179.22,42.06 180.14,42.98 U$6.P$12 180.37,42.98 181.74,41.6 183.11,41.6 184.48,40.23 240.03,40.23 242.77,42.98 243.69,42.98 U$8.P$12 | v145.16,33.15 145.16,39.09 146.76,40.69
SEG1  (via drill 0.35)
  Top 0.305: U$1.P$15 11.43,42.98 12.34,42.98 13.72,41.6 41.6,41.6 42.98,42.98 U$2.P$15 43.2,42.98 44.12,42.98 53.03,34.06 67.89,34.06 v74.07,40.23 | U$3.P$15 74.98,42.98 75.89,42.98 76.81,42.06 80.7,42.06 81.61,42.98 81.61,43.89 81.84,44.12 105.61,44.12 106.53,43.2 U$4.P$15 106.53,42.98 106.53,42.52 v105.39,41.38 | 136.02,27.43 137.39,27.43 IC1.24 | 136.02,27.43 131.67,27.43 A1.1 | 136.02,27.43 v136.02,27.66 | v161.85,34.75 170.08,42.98 U$6.P$15 | v182.65,40.92 198.88,40.92 200.94,42.98 201.85,42.98 U$7.P$15
  Bottom 0.305: v74.07,40.23 74.07,42.29 74.75,42.98 U$3.P$15 | 138.3,32.46 138.3,29.95 v136.02,27.66 | 138.3,32.46 138.3,35.66 | 138.3,35.66 138.3,42.98 U$5.P$15 | 138.3,32.46 145.62,32.46 147.9,34.75 v161.85,34.75 170.76,34.75 176.94,40.92 v182.65,40.92 183.79,39.78 242.32,39.78 244.83,42.29 244.83,43.66 243.92,44.58 235.23,44.58 233.86,43.2 U$8.P$15 | v105.39,41.38 105.84,41.38 111.56,35.66 138.3,35.66
SEG2  (via drill 0.35)
  Top 0.305: v134.19,28.8 137.39,28.8 IC1.23 | v132.59,30.4 131.67,30.4 A0.1 131.44,30.63 131.44,31.32 v122.07,40.69 121.16,39.78 v90.98,39.78 | U$5.P$11 150.88,42.98 150.19,42.98 148.59,41.38 125.27,41.38 122.53,44.12 120.47,44.12 119.56,43.2 U$4.P$11 | v229.51,42.06 231.8,42.06 232.03,42.29 232.03,43.2 232.94,44.12 239.34,44.12 239.8,43.66 239.8,42.75 240.49,42.06 244.6,42.06 245.52,42.98 246.2,42.98 U$8.P$11 | v176.48,43.43 177.16,44.12 181.74,44.12 182.65,43.2 U$6.P$11
  Bottom 0.305: U$1.P$11 24.23,43.2 25.15,43.2 26.06,44.12 37.26,44.12 39.78,41.6 54.41,41.6 55.78,42.98 U$2.P$11 56.01,43.2 56.92,44.12 58.98,44.12 63.55,39.55 83.21,39.55 86.64,42.98 87.55,42.98 U$3.P$11 87.78,42.98 v90.98,39.78 | v122.07,40.69 121.16,41.6 120.93,41.6 119.56,42.98 U$4.P$11 | v132.59,30.4 v134.19,28.8 | U$6.P$11 182.88,42.98 183.79,42.98 184.71,42.06 202.54,42.06 203.45,42.98 203.45,43.89 203.68,44.12 213.51,44.12 214.43,43.2 U$7.P$11 214.66,42.98 215.57,42.06 v229.51,42.06 | v176.48,43.43 176.48,42.52 175.56,41.6 153.39,41.6 152.02,42.98 151.1,42.98 U$5.P$11
SEG3
  Top 0.305: U$7.P$1 216.94,2.74 215.8,1.6 195.68,1.6 194.54,2.74 185.4,2.74 U$6.P$1 185.17,2.74 184.25,2.74 183.57,2.06 174.42,2.06 173.74,2.74 173.74,3.66 173.51,3.89 171.91,3.89 171.22,3.2 171.22,2.29 170.99,2.06 154.53,2.06 153.85,2.74 U$5.P$1 | IC1.22 137.39,29.72 132.36,29.72 131.67,29.03 125.5,29.03 125.04,28.57 125.04,20.8 123.44,19.2 109.27,19.2 93.04,2.97 90.3,2.97 U$3.P$1
  Bottom 0.305: U$8.P$1 248.72,2.97 248.03,2.97 246.66,4.34 218.54,4.34 217.17,2.97 U$7.P$1 | U$5.P$1 153.62,2.74 152.48,1.6 133.04,1.6 131.9,2.74 122.07,2.74 U$4.P$1 121.84,2.97 120.02,4.8 94.18,4.8 92.35,2.97 90.3,2.97 U$3.P$1 90.07,2.97 89.15,3.89 69.04,3.89 68.12,2.97 58.52,2.97 U$2.P$1 58.29,2.74 57.15,1.6 34.06,1.6 32.92,2.74 26.75,2.74 U$1.P$1
SEG4  (via drill 0.35)
  Top 0.305: 45.49,2.97 44.58,3.89 37.26,3.89 34.98,1.6 16.23,1.6 15.09,2.74 13.95,2.74 U$1.P$6 | v55.32,4.57 74.98,4.57 76.58,2.97 77.27,2.97 U$3.P$6 | 45.49,2.97 48.46,5.94 v53.95,5.94 60.58,5.94 64.01,9.37 v64.01,13.03 | 45.49,2.97 U$2.P$6 | v136.02,30.4 136.7,31.09 137.39,31.09 IC1.21 | v133.96,26.75 133.96,24.92 130.53,21.49 | 130.53,21.49 128.25,19.2 124.13,19.2 123.67,18.75 109.73,18.75 100.58,9.6 100.58,2.29 100.81,2.06 103.1,2.06 | 103.1,2.06 108.36,2.06 109.04,2.74 U$4.P$6 | 147.45,1.6 171.45,1.6 172.59,2.74 U$6.P$6 | 147.45,1.6 143.1,1.6 141.96,2.74 141.05,2.74 U$5.P$6 | v132.59,19.43 130.53,21.49 | v147.9,10.97 147.9,4.12 147.45,3.66 147.45,1.6 | v104.01,11.2 104.01,4.57 103.1,3.66 103.1,2.06
  Bottom 0.305: v53.95,5.94 v55.32,4.57 | v136.02,30.4 136.02,28.8 v133.96,26.75 | U$6.P$6 172.82,2.74 173.97,1.6 203.22,1.6 204.37,2.74 U$7.P$6 204.6,2.74 205.74,1.6 234.09,1.6 235.23,2.74 236.14,2.74 U$8.P$6 | v132.59,19.43 133.04,19.43 141.5,10.97 v147.9,10.97 | v64.01,13.03 88.24,13.03 90.07,11.2 v104.01,11.2
SEG5  (via drill 0.35)
  Top 0.305: v186.54,3.89 194.08,3.89 195.91,2.06 211.23,2.06 211.91,2.74 U$7.P$3 | v131.67,32.23 137.39,32.23 IC1.20 | v118.87,25.38 113.16,19.66 109.04,19.66 93.04,3.66 91.21,3.66 90.98,3.89 89.38,3.89 88.7,3.2 88.7,2.29 | 88.7,2.29 88.47,2.06 85.95,2.06 85.27,2.74 U$3.P$3 85.27,2.97 85.5,3.2 v85.5,4.57 | 88.7,2.29 89.38,1.6 114.53,1.6 115.67,2.74 116.59,2.74 U$4.P$3 116.81,8.46 124.13,15.77 v125.04,15.77 | v67.89,3.89 55.09,3.89 54.18,2.97 53.49,2.97 U$2.P$3 | v148.59,11.66 148.59,2.97 U$5.P$3
  Bottom 0.305: U$5.P$3 148.59,2.97 149.5,2.97 150.42,3.89 162.53,3.89 164.36,2.06 170.99,2.06 171.68,2.74 171.68,3.66 171.91,3.89 173.51,3.89 174.19,3.2 174.19,2.29 174.42,2.06 179.45,2.06 180.14,2.74 U$6.P$3 180.37,2.97 181.05,2.97 181.97,3.89 v186.54,3.89 | U$7.P$3 212.14,2.97 212.83,2.97 217.17,7.32 246.2,7.32 249.86,3.66 249.86,2.29 249.63,2.06 244.6,2.06 243.92,2.74 U$8.P$3 | U$1.P$3 21.72,2.97 22.4,2.97 24.23,4.8 47.09,4.8 48.01,3.89 52.35,3.89 53.26,2.97 U$2.P$3 | v131.67,32.23 129.16,32.23 122.07,25.15 119.1,25.15 v118.87,25.38 | v67.89,3.89 68.35,3.89 69.04,4.57 v85.5,4.57 | v148.59,11.66 141.5,11.66 133.04,20.12 129.39,20.12 v125.04,15.77
SEG6  (via drill 0.35)
  Top 0.305: 172.14,4.8 170.31,2.97 U$6.P$7 | v176.02,4.8 172.14,4.8 | U$8.P$7 233.63,2.74 232.49,2.74 231.34,1.6 220.14,1.6 217.4,4.34 203.45,4.34 202.08,2.97 U$7.P$7 | v130.3,33.6 137.39,33.6 IC1.19 | v121.61,25.83 120.93,25.83 v114.99,19.89 | U$4.P$7 106.76,2.97 106.76,7.54 v110.41,11.2 118.87,11.2 121.39,13.72 | v136.25,5.03 136.25,5.71 125.5,16.46 124.13,16.46 121.39,13.72 | 72.01,5.26 53.95,5.26 51.66,2.97 51.66,2.06 43.89,2.06 43.2,2.74 U$2.P$7 | 72.01,5.26 76.81,5.26 78.41,3.66 78.41,2.29 78.18,2.06 76.58,2.06 75.89,2.74 74.98,2.74 U$3.P$7 | 72.01,5.26 v72.01,11.89 | 172.14,4.8 172.14,5.71 v166.65,11.2 | 121.39,13.72 v121.16,13.95
  Bottom 0.305: v176.02,4.8 176.48,4.8 176.71,5.03 199.8,5.03 201.85,2.97 U$7.P$7 | v130.3,33.6 129.39,33.6 v121.61,25.83 | v114.99,19.89 114.99,15.77 v110.41,11.2 105.16,11.2 104.47,10.52 91.44,10.52 91.21,10.74 80.24,10.74 79.1,11.89 v72.01,11.89 | v136.25,5.03 138.3,2.97 U$5.P$7 | U$1.P$7 11.43,2.74 12.34,2.74 13.49,1.6 24.46,1.6 25.6,2.74 25.6,3.66 26.29,4.34 41.6,4.34 42.98,2.97 U$2.P$7 | v166.65,11.2 157.05,11.2 145.39,22.86 134.19,22.86 133.27,21.95 127.56,21.95 121.16,15.54 v121.16,13.95
SEG7  (via drill 0.35)
  Top 0.305: U$1.P$17 8.91,43.2 9.83,43.2 11.2,44.58 39.09,44.58 40.46,43.2 U$2.P$17 40.69,43.2 42.06,44.58 70.87,44.58 72.24,43.2 U$3.P$17 72.24,42.98 72.24,41.38 v69.27,38.41 | v135.79,36.35 136.7,35.43 136.93,35.43 137.39,34.98 IC1.18
  Bottom 0.305: U$8.P$17 230.89,43.2 229.51,44.58 201.62,44.58 200.25,43.2 199.57,43.2 U$7.P$17 199.34,43.2 187,43.2 185.62,44.58 169.16,44.58 167.79,43.2 U$6.P$17 167.56,43.2 156.59,43.2 155.22,44.58 137.39,44.58 136.02,43.2 U$5.P$17 135.79,42.98 135.79,40.01 | 135.79,40.01 v135.79,36.35 | 135.79,40.01 107.9,40.01 104.93,42.98 104.24,42.98 U$4.P$17 104.01,42.98 99.44,38.41 v69.27,38.41
SEG8  (via drill 0.35)
  Top 0.305: IC1.17 137.62,36.35 138.3,36.35 v138.99,37.03 139.45,37.03 140.59,38.18 150.88,38.18 156.82,44.12 170.76,44.12 171.68,43.2 172.59,43.2 U$6.P$16 | U$5.P$16 140.82,43.2 139.45,44.58 111.56,44.58 110.19,43.2 109.27,43.2 U$4.P$16 109.04,43.2 108.13,43.2 106.76,44.58 78.87,44.58 77.5,43.2 U$3.P$16
  Bottom 0.305: U$6.P$16 172.82,43.2 173.74,43.2 174.65,44.12 181.05,44.12 181.74,43.43 181.74,42.52 182.19,42.06 184.02,42.06 184.48,41.6 203,41.6 204.37,42.98 U$7.P$16 204.6,42.98 206.88,40.69 233.86,40.69 236.14,42.98 U$8.P$16 | v138.99,37.03 138.99,37.49 138.76,37.72 138.76,40.92 140.82,42.98 U$5.P$16 | U$1.P$16 13.95,43.2 14.86,43.2 16.23,44.58 44.12,44.58 45.49,43.2 U$2.P$16 45.72,43.2 47.09,44.58 75.89,44.58 77.27,43.2 U$3.P$16
SEG9  (via drill 0.35)
  Top 0.305: v39.32,43.2 38.41,44.12 18.29,44.12 17.37,43.2 16.69,43.2 U$1.P$14 | v77.72,40.92 73.61,40.92 69.95,37.26 61.72,37.26 59.21,39.78 52.35,39.78 49.15,42.98 48.23,42.98 U$2.P$14 | U$8.P$14 238.66,42.98 237.06,41.38 v208.71,41.38 207.57,41.38 205.97,39.78 199.8,39.78 199.34,39.32 178.99,39.32 175.34,42.98 U$6.P$14 | v139.45,38.18 138.99,37.72 137.62,37.72 IC1.16 137.39,37.72 126.87,37.72 123.22,41.38 v114.3,41.38 | v154.76,43.89 154.53,43.89 154.31,44.12 144.47,44.12 143.56,43.2 U$5.P$14
  Bottom 0.305: v39.32,43.2 39.32,42.75 40.01,42.06 47.09,42.06 48.01,42.98 U$2.P$14 | v77.72,40.92 79.78,42.98 U$3.P$14 80.01,43.2 80.92,43.2 81.84,44.12 88.24,44.12 89.15,43.2 89.15,42.29 89.38,42.06 101.5,42.06 103.56,44.12 110.64,44.12 111.56,43.2 U$4.P$14 111.78,42.98 112.7,42.98 v114.3,41.38 | v208.71,41.38 207.11,42.98 U$7.P$14 | v139.45,38.18 139.45,39.09 143.33,42.98 U$5.P$14 | v154.76,43.89 156.59,42.06 173.28,42.06 174.19,42.98 175.11,42.98 U$6.P$14
SEG10  (via drill 0.35)
  Top 0.305: U$8.P$13 241.17,43.2 239.8,44.58 230.89,44.58 228.37,42.06 211.46,42.06 210.54,42.98 209.63,42.98 U$7.P$13 209.4,42.98 208.48,42.98 205.74,40.23 199.57,40.23 199.11,39.78 181.05,39.78 177.85,42.98 U$6.P$13 | U$1.P$13 19.2,42.98 19.89,42.98 20.8,42.06 41.38,42.06 42.06,42.75 42.06,43.66 42.52,44.12 49.84,44.12 50.75,43.2 U$2.P$13 50.98,43.2 51.66,43.2 52.58,44.12 56.46,44.12 57.38,43.2 57.38,42.29 61.95,37.72 69.72,37.72 73.61,41.6 80.92,41.6 82.3,42.98 U$3.P$13 82.53,42.98 83.44,42.98 85.95,40.46 104.47,40.46 104.7,40.23 111.33,40.23 114.07,42.98 U$4.P$13 114.3,42.98 115.21,42.06 123.22,42.06 126.42,38.86 137.39,38.86 IC1.15 | v125.73,42.06 144.25,42.06 145.16,42.98 145.85,42.98 U$5.P$13
  Bottom 0.305: U$5.P$13 146.07,42.98 146.99,42.98 148.82,41.15 175.79,41.15 177.62,42.98 U$6.P$13 | v125.73,42.06 121.16,42.06 120.24,42.98 120.24,43.89 120.02,44.12 115.21,44.12 114.3,43.2 U$4.P$13
SEG11  (via drill 0.35)
  Top 0.305: U$7.P$10 216.94,43.2 215.57,44.58 199.11,44.58 197.74,43.2 185.4,43.2 U$6.P$10 185.17,43.2 184.48,43.2 183.11,44.58 156.59,44.58 155.22,43.2 153.85,43.2 U$5.P$10 153.62,42.98 149.5,38.86 146.99,38.86 IC1.14 146.76,38.86 139.22,38.86 137.16,40.92 125.04,40.92 122.99,42.98 122.07,42.98 U$4.P$10 | v242.54,43.89 242.77,44.12 246.89,44.12 247.8,43.2 248.72,43.2 U$8.P$10 | v70.87,43.2 58.52,43.2 U$2.P$10
  Bottom 0.305: v242.54,43.89 242.09,43.89 241.86,44.12 235.46,44.12 234.54,43.2 234.54,42.29 234.31,42.06 230.43,42.06 230.2,42.29 230.2,42.52 229.74,42.98 217.17,42.98 U$7.P$10 | U$1.P$10 26.75,42.98 37.72,42.98 39.55,41.15 56.46,41.15 58.29,42.98 U$2.P$10 | U$4.P$10 121.84,43.2 120.47,44.58 103.33,44.58 101.96,43.2 90.3,43.2 U$3.P$10 90.07,43.2 88.7,44.58 79.78,44.58 78.87,43.66 78.87,42.75 78.18,42.06 76.81,42.06 76.35,42.52 76.35,43.2 75.44,44.12 71.78,44.12 v70.87,43.2
SEG12  (via drill 0.35)
  Top 0.305: v90.53,9.6 87.78,6.86 87.78,2.97 U$3.P$2 | v119.33,9.83 118.87,9.37 118.87,3.43 119.33,2.97 U$4.P$2 | v244.15,5.03 246.2,2.97 U$8.P$2 | v150.88,34.06 147.45,37.49 146.99,37.49 IC1.13 | v150.88,26.29 v150.88,10.29 150.88,2.97 U$5.P$2 | v163.68,26.29 v179.68,10.29 182.65,7.32 182.65,2.97 U$6.P$2
  Bottom 0.305: U$1.P$2 24,2.74 23.09,2.74 22.4,2.06 20.8,2.06 20.57,2.29 20.57,3.66 22.17,5.26 47.32,5.26 48.23,4.34 54.41,4.34 55.78,2.97 U$2.P$2 56.01,2.97 57.38,4.34 58.29,4.34 64.47,10.52 79.78,10.52 80.92,9.37 88.92,9.37 89.15,9.6 v90.53,9.6 111.1,9.6 111.33,9.83 v119.33,9.83 144.47,9.83 144.93,10.29 v150.88,10.29 | v244.15,5.03 216.26,5.03 214.66,3.43 214.66,2.97 U$7.P$2 214.43,2.74 213.51,2.74 212.83,2.06 208.71,2.06 208.03,2.74 208.03,3.66 201.17,10.52 179.91,10.52 v179.68,10.29 | v150.88,34.06 v150.88,26.29 v163.68,26.29
SEG13  (via drill 0.35)
  Top 0.305: v48.69,5.03 50.75,2.97 U$2.P$4 | v75.67,9.6 81.84,3.43 | 81.84,3.43 82.3,2.97 U$3.P$4 | v110.64,10.29 114.07,6.86 114.07,2.97 U$4.P$4 | 81.84,3.43 v88.47,10.06 | v150.19,33.38 147.45,36.12 146.99,36.12 IC1.12 | v150.19,25.6 v150.19,24.23 150.19,14.4 146.76,10.97 146.76,3.66 146.07,2.97 U$5.P$4 | v156.36,25.6 175.11,6.86 | 175.11,6.86 177.62,4.34 177.62,2.97 U$6.P$4 | 175.11,6.86 v178.54,10.29
  Bottom 0.305: v48.69,5.03 48.01,5.71 21.95,5.71 19.2,2.97 U$1.P$4 | v75.67,9.6 64.24,9.6 58.52,3.89 57.61,3.89 56.92,3.2 56.92,2.29 56.69,2.06 51.66,2.06 50.98,2.74 U$2.P$4 | v88.47,10.06 88.7,10.29 90.98,10.29 91.21,10.06 104.7,10.06 104.93,10.29 v110.64,10.29 111.33,10.29 124.82,23.77 138.76,23.77 139.22,24.23 v150.19,24.23 | U$8.P$4 241.4,2.74 242.54,1.6 249.86,1.6 250.32,2.06 250.32,3.89 246.43,7.77 215.11,7.77 210.31,2.97 209.63,2.97 U$7.P$4 209.4,2.97 201.4,10.97 179.22,10.97 v178.54,10.29 | v150.19,33.38 v150.19,25.6 v156.36,25.6
SEG14  (via drill 0.35)
  Top 0.305: v34.52,2.29 34.29,2.06 18.29,2.06 17.6,2.74 16.69,2.74 U$1.P$5 | v74.98,11.2 74.98,7.77 79.78,2.97 U$3.P$5 | v149.28,33.15 147.68,34.75 146.99,34.75 IC1.11 | v149.28,25.6 149.28,14.17 146.3,11.2 146.3,5.71 143.56,2.97 U$5.P$5 143.33,2.97 142.42,3.89 135.1,3.89 134.87,3.66 134.87,2.74 134.19,2.06 132.59,2.06 130.53,4.12 v119.56,4.12 | v215.8,3.43 215.34,3.89 208.03,3.89 207.11,2.97 U$7.P$5
  Bottom 0.305: v34.52,2.29 37.03,2.29 37.26,2.06 47.32,2.06 48.01,2.74 U$2.P$5 | U$3.P$5 80.01,2.74 80.92,2.74 81.61,2.06 98.98,2.06 100.81,3.89 110.64,3.89 111.56,2.97 U$4.P$5 111.78,2.97 112.47,2.97 113.61,4.12 v119.56,4.12 | v74.98,11.2 64.69,11.2 62.87,13.03 58.75,13.03 57.84,12.12 20.57,12.12 19.66,13.03 15.77,13.03 13.95,11.2 13.95,9.14 16.46,6.63 16.46,2.97 U$1.P$5 | v149.28,25.6 v149.28,33.15 | U$5.P$5 143.56,2.97 145.39,4.8 173.28,4.8 175.11,2.97 U$6.P$5 175.34,2.97 176.94,4.57 187,4.57 189.51,2.06 202.77,2.06 203,2.29 203,3.2 203.68,3.89 205.28,3.89 206.2,2.97 206.88,2.97 U$7.P$5 | v215.8,3.43 215.8,2.52 216.26,2.06 217.86,2.06 219.69,3.89 237.06,3.89 237.97,2.97 238.66,2.97 U$8.P$5
SEG15  (via drill 0.35)
  Top 0.305: v34.52,3.66 34.29,3.89 10.52,3.89 9.6,2.97 8.91,2.97 U$1.P$8 | U$2.P$8 40.69,2.74 41.6,2.74 42.75,1.6 66.75,1.6 69.04,3.89 71.32,3.89 72.24,2.97 U$3.P$8 | U$8.P$8 230.89,2.74 230.2,2.06 227.69,2.06 224.94,4.8 202.08,4.8 200.25,2.97 199.57,2.97 U$7.P$8 199.34,2.97 v192.48,9.83 | v148.36,32.92 147.68,33.6 146.99,33.6 IC1.10 | v148.36,30.4 148.59,30.4 165.96,13.03 v165.96,9.83 165.96,4.57 167.56,2.97 U$6.P$8 | v131.44,2.06 131.9,2.06 132.36,1.6 134.65,1.6 135.79,2.74 U$5.P$8
  Bottom 0.305: v34.52,3.66 34.75,3.66 34.98,3.89 39.55,3.89 40.46,2.97 U$2.P$8 | U$3.P$8 72.47,2.74 73.38,2.74 74.52,1.6 102.87,1.6 104.01,2.74 U$4.P$8 104.24,2.74 105.16,2.74 105.84,2.06 v131.44,2.06 | v148.36,30.4 v148.36,32.92 | U$5.P$8 136.02,2.74 136.93,2.74 137.62,2.06 146.76,2.06 147.45,2.74 147.45,3.66 148.13,4.34 166.19,4.34 167.56,2.97 U$6.P$8 | v192.48,9.83 185.62,9.83 185.4,10.06 180.59,10.06 180.14,9.6 166.19,9.6 v165.96,9.83
VCC  (via drill 0.35, 0.55)
  Top 0.305: TCA9517.5 86.64,14.51 R4.2 90.75,12.79 R5.2 | 87.34,20.23 C3.1 | U$13.VIN 20.7,14.86 v20.7,14.99
  Top 0.381: v64.52,20.57 64.64,20.7 64.64,25.15 64.77,25.15 v64.9,25.27 | v77.6,25.91 77.6,27.5 C4.1 | v84.96,25.78 84.96,20.28 TCA9517.8
  Top 0.406: _.1 73.63,20.16 73.53,20.07 v73.28,20.07 | v64.52,20.57 64.52,16.38 v64.66,16.24
  Top 0.635: TCA9517.8 87.26,20.14 87.34,20.23 | 91.82,12.49 R5.2 92.2,12.7
  Top 0.762: IC2.3 77.34,30.3 77.34,27.75 C4.1 | IC1.28 137.87,22.27 139.7,20.45 141.04,20.45 C7.1 141.49,19.89 C2.+ 141.49,6.62 v140.21,5.33
  Top 1.143: v92.84,4.7 92.71,4.7 92.11,5.29 R5.2 92.45,12.45 v94.23,12.45
  Top 1.524: 199.9,13.07 J1.1 188.85,12.57 v188.85,6.48 | 65.41,15.49 65.41,6.73 65.79,6.35 v67.18,6.35 | 199.9,13.07 199.9,13.48 C1.+ | 199.9,13.07 200.66,13.07 v200.69,13.1
  Top 1.651: v188.85,6.48 189.11,6.74
  Top 1.778: v64.66,16.24 65.41,15.49
  Bottom 0.305: v20.7,14.99 20.7,16.24
  Bottom 0.381: v64.9,25.27 77.22,25.27 77.6,25.65 v77.6,25.91 84.71,25.91 84.84,25.78 v84.96,25.78
  Bottom 0.406: v73.28,20.07 72.52,20.83 64.64,20.83 64.64,20.7 v64.52,20.57
  Bottom 0.635: 98.47,12.7 ..1
  Bottom 0.762: v140.21,5.33 140.34,5.33 140.21,5.46 140.21,6.35
  Bottom 1.143: v92.84,4.7 93.85,5.71 93.85,6.35 | ..1 98.39,12.45 v94.23,12.45
  Bottom 1.524: SV2.6 SV2.5 SV2.4 8.82,16.51 C5.1 20.7,16.24 61.99,16.24 | 200.66,13.07 243.33,13.07 244.2,13.07 SV1.4 | v67.18,6.35 93.85,6.35 140.21,6.35 170.05,6.35
  Bottom 1.651: 170.05,6.35 188.59,6.35 188.72,6.48 v188.85,6.48
  Bottom 1.778: 244.35,14.09 243.33,13.07 244.21,12.19 244.35,12.19 244.35,14.09 | 244.35,14.09 244.35,16.26 244.6,16.51 SV1.5 SV1.3 244.6,11.43 244.35,11.68 | SV2.6 5.84,11.43 6.1,11.68 | 6.1,11.68 5.59,12.19 5.59,15.75 7.62,15.75 8.13,15.24 6.1,13.21 6.1,11.68 | C1.+ v200.69,13.1 200.66,13.07 | 59.44,16.51 61.72,16.51 61.99,16.24 v64.66,16.24 64.77,16.13 | 59.44,16.51 8.82,16.51 | 59.56,16.38 59.44,16.51
  other vias: 200.69,14.28

### Text on the board
Top: Did you ever hear the tragedy of Darth Plagueis The Wise? / I thought not. It’s not a story the Jedi would tell you. It’s a / Sith legend. Darth Plagueis was a Dark Lord of the Sith, / so powerful and so wise he could use the Force to influence / the midichlorians to create life… He had such a knowledge / of the dark side that he could even keep the ones he cared / about from dying. The dark side of the Force is a pathway / to many abilities some consider to be unnatural. He became / so powerful… the only thing he was afraid of was losing his / power, which eventually, of course, he did. Unfortunately, he / taught his apprentice everything he knew, then his apprentice / killed him in his sleep. Ironic. He could save others from death / , but not himself. | Bypass
_tsilk: Out | +5v | Gnd | Gnd | Gnd | Gnd | Gnd | I2C Buffer | Gnd | 3.3v | Gnd | SDA | +5V | SCL | To bypass buffer, / bridge jumpers | under IC footprint | +5V | +5v | +5v | +5V | SDA | SCL
_bsilk: NodeMCU | GND | GND | ESP8266 | I2C In Volts: | Gnd | GND | GND | 5v | 3.3v | GND | +5V | +5V | +5V | +5v | +5V | SDA_IN | SDA | SCL_IN | SCL